# EAGLE design TUE-JJ-9-1 (EAGLE 9.6.2)
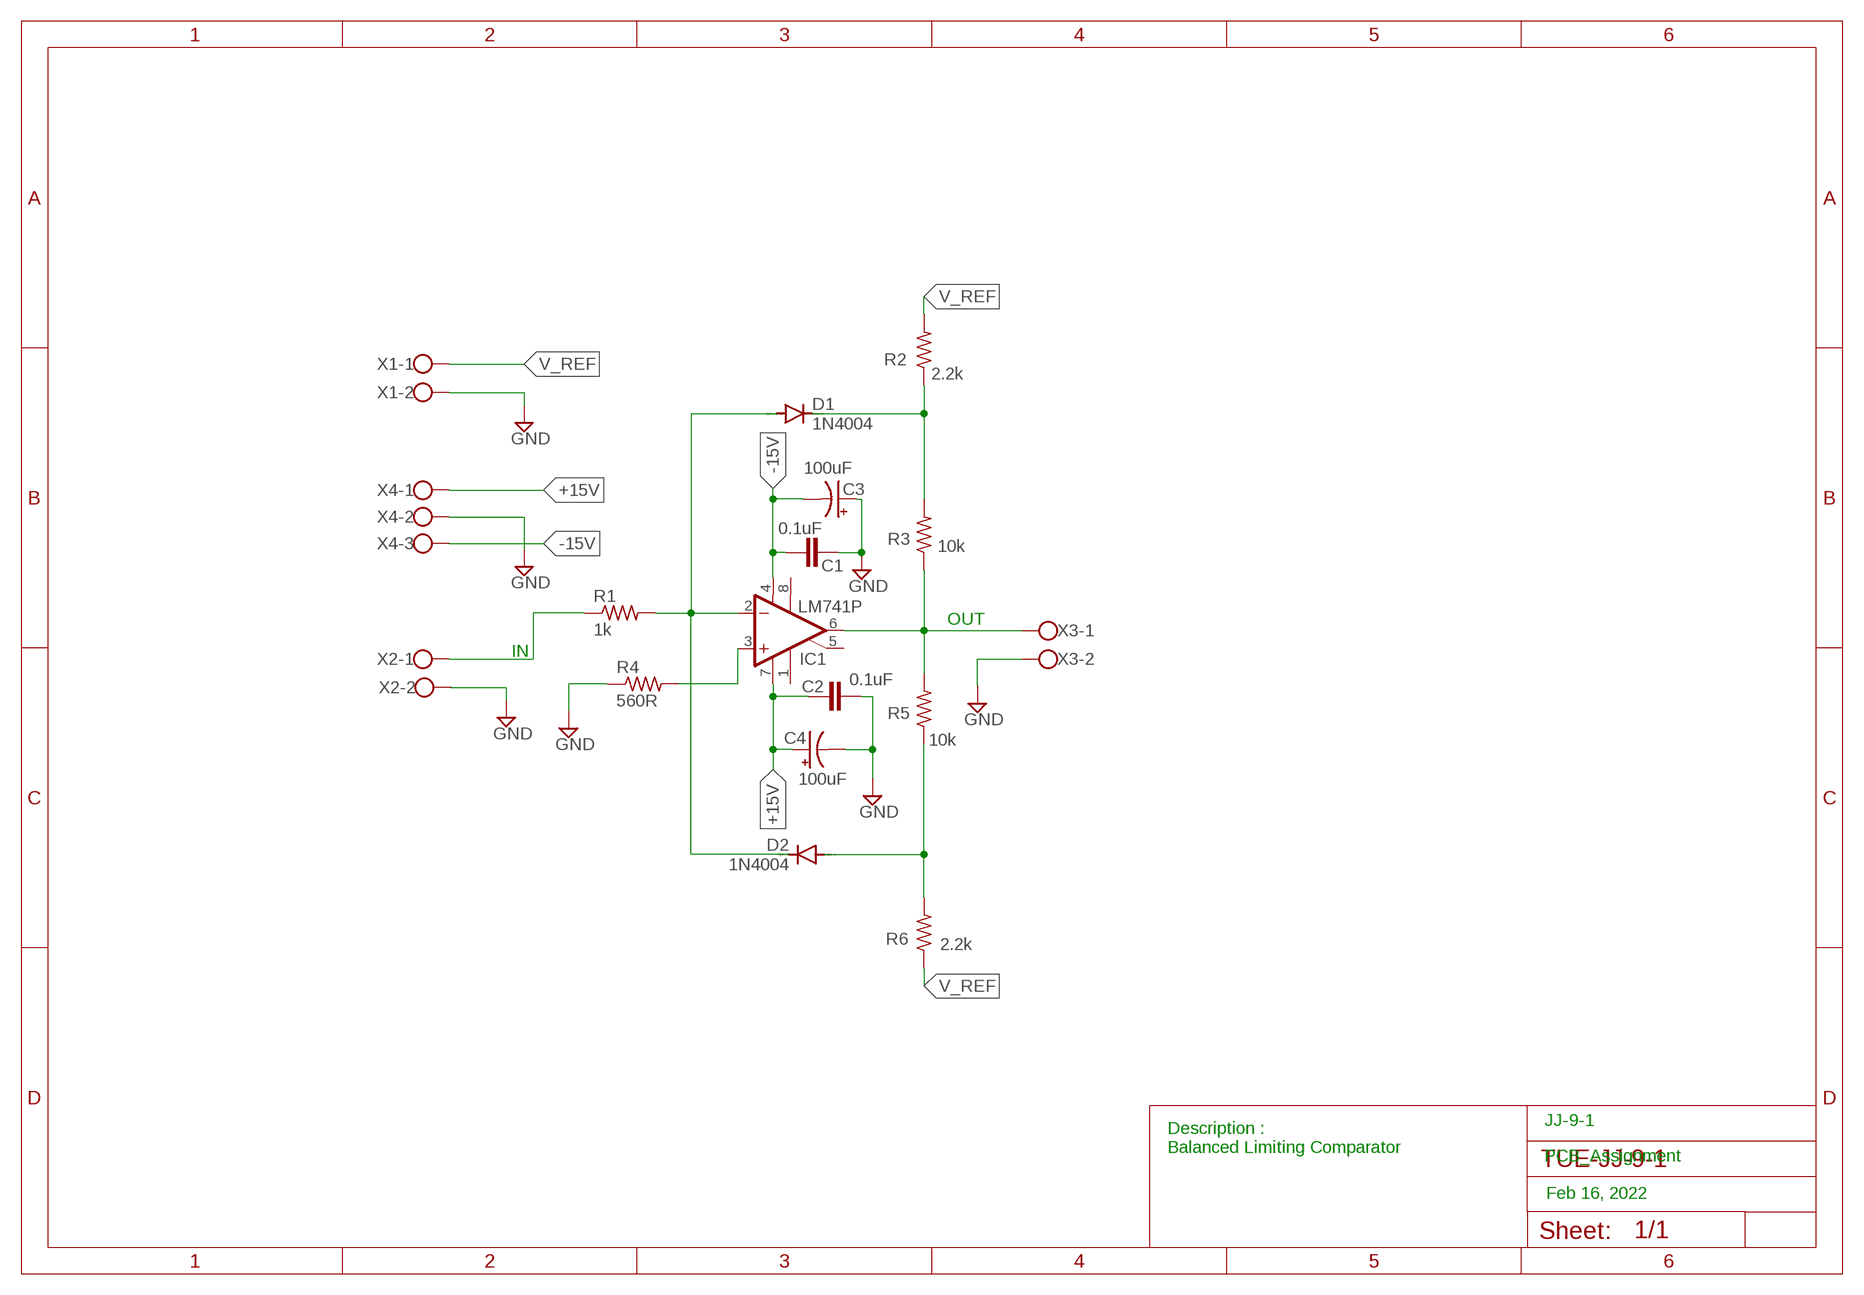
[diagram p0: schematic, sheet 1]

## Parts
C1  0.1uF  C-EU050-025X075  [C050-025X075]
C2  0.1uF  C-EU050-025X075  [C050-025X075]
C3  100uF  CPOL-USE2.5-7  [E2,5-7]
C4  100uF  CPOL-USE2.5-7  [E2,5-7]
D1  1N4004  [DO41-10]
D2  1N4004  [DO41-10]
IC1  LM741P  [DIL08]
R1  1k  R-US_0207/10  [0207/10]
R2  2.2k  R-US_0207/10  [0207/10]
R3  10k  R-US_0207/10  [0207/10]
R4  560R  R-US_0207/10  [0207/10]
R5  10k  R-US_0207/10  [0207/10]
R6  2.2k  R-US_0207/10  [0207/10]
X1  W237-102  [W237-102]
X2  W237-102  [W237-102]
X3  W237-102  [W237-102]
X4  W237-103  [W237-103]

## Nets
+15V: C2.1 C4.+ IC1.7(V+) X4.1
-15V: C1.1 C3.- IC1.4(V-) X4.3
GND: C1.2 C2.2 C3.+ C4.- R4.1 X1.2 X2.2 X3.2 X4.2
N$1: IC1.3(+IN) R4.2
N$2: D1.A D2.C IC1.2(-IN) R1.2
N$3: D1.C R2.1 R3.2
N$4: IC1.6(OUT) R3.1 R5.2 X3.1
N$5: D2.A R5.1 R6.2
N$6: R1.1 X2.1
V_REF: R2.2 R6.1 X1.1
Unconnected: IC1.1(ON1) IC1.5(ON2) IC1.8(OPT)

## Notes on the sheet
- OUT
- IN
- JJ-9-1
- Description :
  Balanced Limiting Comparator
- PCB_Assignment
- Feb 16, 2022

## Library data of the parts
C1 C2 = rcl:C-EU: CAPACITOR, European symbol; SPICEPREFIX: C
C3 C4 = rcl:CPOL-US: POLARIZED CAPACITOR, American symbol; SPICEPREFIX: C
D1 D2 = diode:1N4004: DIODE general purpose rectifier, 1 A
IC1 = linear:*741: OP AMP
R1-R6 = rcl:R-US_: RESISTOR, American symbol; SPICEPREFIX: R
X1-X3 = con-wago-500:W237-102: WAGO SCREW CLAMP; MPN: 237-102; OC_FARNELL: unknown; OC_NEWARK: 70K9898
X4 = con-wago-500:W237-103: WAGO SCREW CLAMP; MPN: 237-103; OC_FARNELL: unknown; OC_NEWARK: 18M7116

## Board
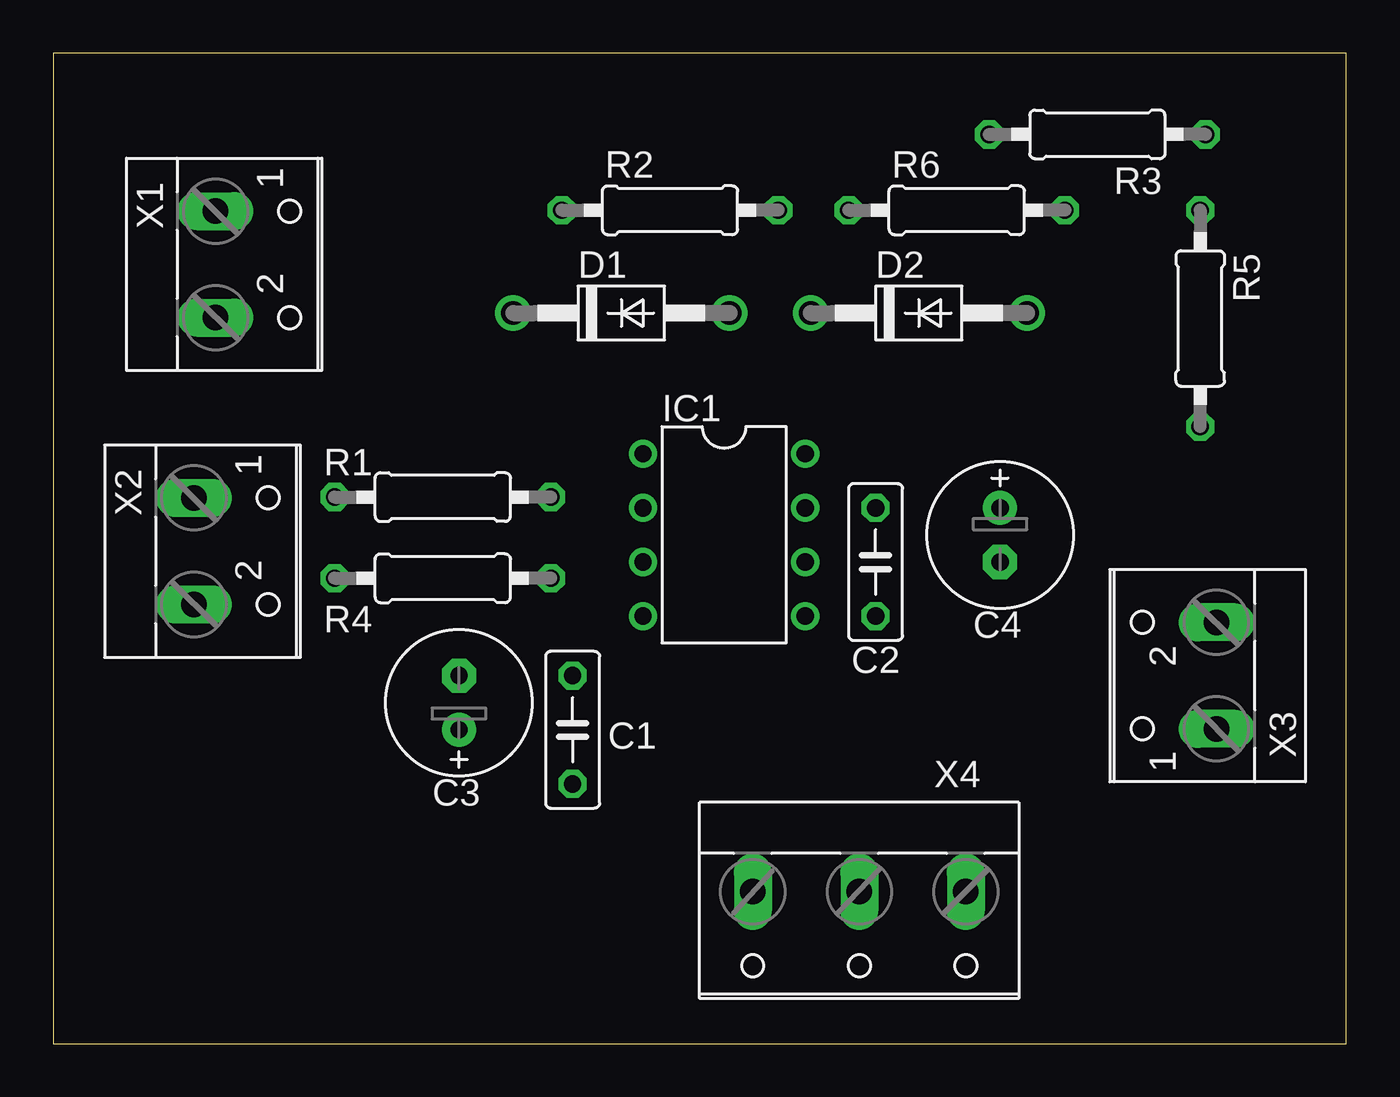
[diagram p1: board, top side]
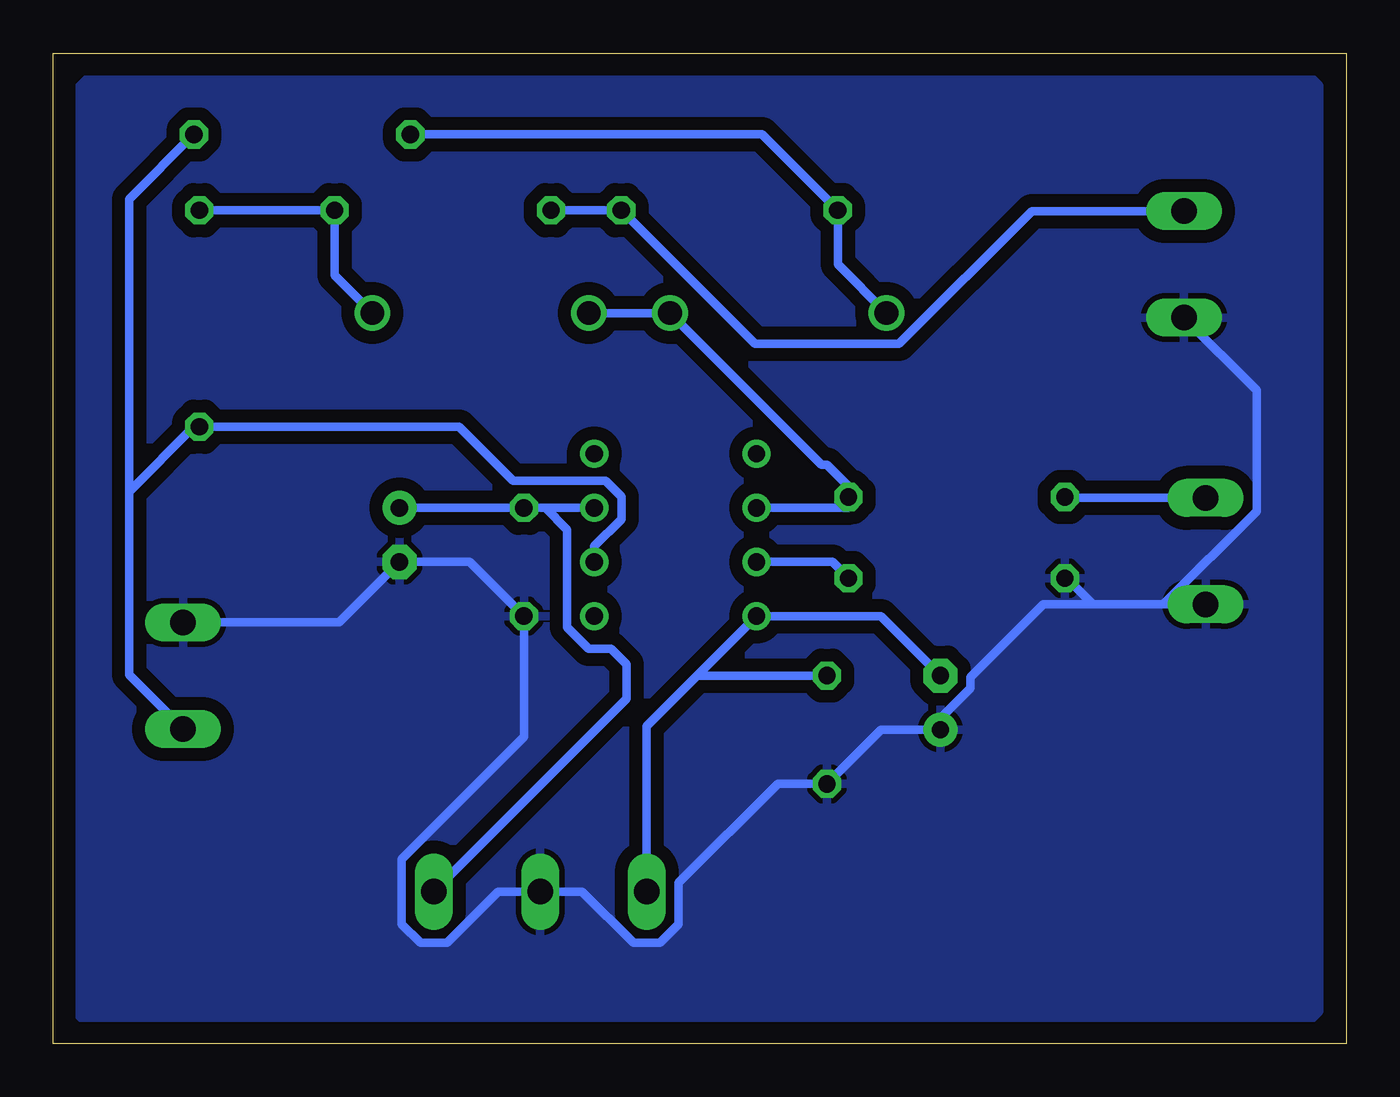
[diagram p2: board, bottom side, seen from below]

Size 60.71 x 46.48 mm. Coordinates in mm from the lower left corner, seen from the top.
Outline: 0,0 60.71,0 60.71,46.48 0,46.48 0,0
Copper layers (1*16): Top 0.035mm / dielectric 1.5mm / Bottom 0.035mm
Design rules "default *": minimum track width 16mil, minimum drill 0.35mm, track to track 24mil, track to pad 16mil, pad to pad 16mil, via to via 16mil, smd to smd 16mil, copper to edge 40mil, drill to drill 16mil, minimum pad ring 10mil, minimum via ring 8mil, stop-mask expansion 4mil, vias tented up to drill 0mil, thermal gap 10mil

### Footprints (pad centres in the part's own frame; a part is rotated, then mirrored left to right if it is on the bottom)
C050-025X075 = drill 0.813 octagon: 1 -2.54,0; 2 2.54,0
E2,5-7 = drill 0.813 pad 1.6: + -1.27,0 | drill 0.813 pad 1.6 octagon: - 1.27,0
DO41-10 = drill 1.118: A 5.08,0; C -5.08,0
DIL08 = drill 0.813 pad 1.27: 1 -3.81,-3.81; 2 -1.27,-3.81; 3 1.27,-3.81; 4 3.81,-3.81; 5 3.81,3.81; 6 1.27,3.81; 7 -1.27,3.81; 8 -3.81,3.81
0207/10 = drill 0.813 octagon: 1 -5.08,0; 2 5.08,0
W237-102 = drill 1.194 long: 1 -2.5,-1.27; 2 2.5,-1.27
W237-103 = drill 1.194 long: 1 -5,-1.29; 2 0,-1.29; 3 5,-1.29

### Placement (x,y rotation side)
C1  24.38,14.73 270 top
C2  38.61,22.61 270 top
C3  19.05,16 90 top
C4  44.45,23.88 270 top
D1  26.67,34.29 0 top
D2  40.64,34.29 0 top
IC1  31.5,23.88 270 top
R1  18.29,25.65 0 top
R2  28.96,39.12 0 top
R3  49.02,42.67 180 top
R4  18.29,21.84 0 top
R5  53.85,34.04 270 top
R6  42.42,39.12 0 top
X1  8.89,36.58 270 top
X2  7.87,23.11 270 top
X3  53.34,17.27 90 top
X4  37.85,5.84 180 top

### Tracks (layer width: path | path; a pad name or v marks a point on that pad's centre or on a via)
+15V
  Bottom 0.406: IC1.7 37.59,25.15 | 37.59,25.15 C2.1 C4.+ 44.5,25.1 | X4.1 33.78,16.2 33.78,17.8 34.53,18.54 35.58,18.54 36.58,19.54 36.58,24.13 37.59,25.15
-15V
  Bottom 0.406: C3.- 21.84,20.07 IC1.4 30.48,17.27 | X4.3 32.85,14.91 31.62,16.13 30.48,17.27 | C1.1 30.48,17.27
GND
  Bottom 0.406: R4.1 13.13,21.84 11.9,20.61 | 19.6,14.73 21.84,14.73 C1.2 26.69,12.19 31.34,7.54 31.34,5.61 32.22,4.73 33.47,4.73 35.87,7.13 X4.2 39.82,7.13 42.22,4.73 43.47,4.73 44.35,5.61 44.35,8.65 38.61,14.39 C2.2 41.15,22.61 C4.- 47.28,19.77 X3.2 | 19.6,14.73 C3.+ 19.05,15.24 | X1.2 4.2,30.66 4.2,24.99 8.58,20.61 | X2.2 8.58,20.61 | 8.58,20.61 14.22,20.61 17.64,17.2 17.64,16.69 19.6,14.73
  pour Bottom: 1.78,45.47 1.27,44.96 1.27,1.52 1.78,1.02 59.18,1.02 59.69,1.52 59.69,44.7 58.93,45.47
N$1
  Bottom 0.406: IC1.3 24.13,22.61 R4.2
N$2
  Bottom 0.406: D2.C D1.A 24.64,27.18 24.38,27.18 23.37,26.16 R1.2 23.37,25.15 IC1.2
N$3
  Bottom 0.406: D1.C 23.88,36.58 R2.1 27.43,42.67 R3.2
N$4
  Bottom 0.406: 57.15,25.91 57.15,17.31 X3.1 | 57.15,25.91 54.1,28.96 R5.2 41.66,28.96 39.12,26.42 34.78,26.42 34.04,25.67 34.04,24.62 35.31,23.35 IC1.6 | R3.1 57.15,39.62 57.15,25.91
N$5
  Bottom 0.406: R5.1 R6.2 47.5,36.07 D2.A
N$6
  Bottom 0.406: X2.1 13.17,25.61 R1.1
V_REF
  Bottom 0.406: R6.1 R2.2 27.76,32.84 20.99,32.84 14.76,39.08 X1.1